# EasyEDA schematic SCH_Shuffl_2024-09-28.json
TITLE: Shuffl PCBC w/o battery; REV: 1.0; Date: 2024-09-28; Sheet: A/A; Drawn By: vasipallieshan; Company: StarKloud
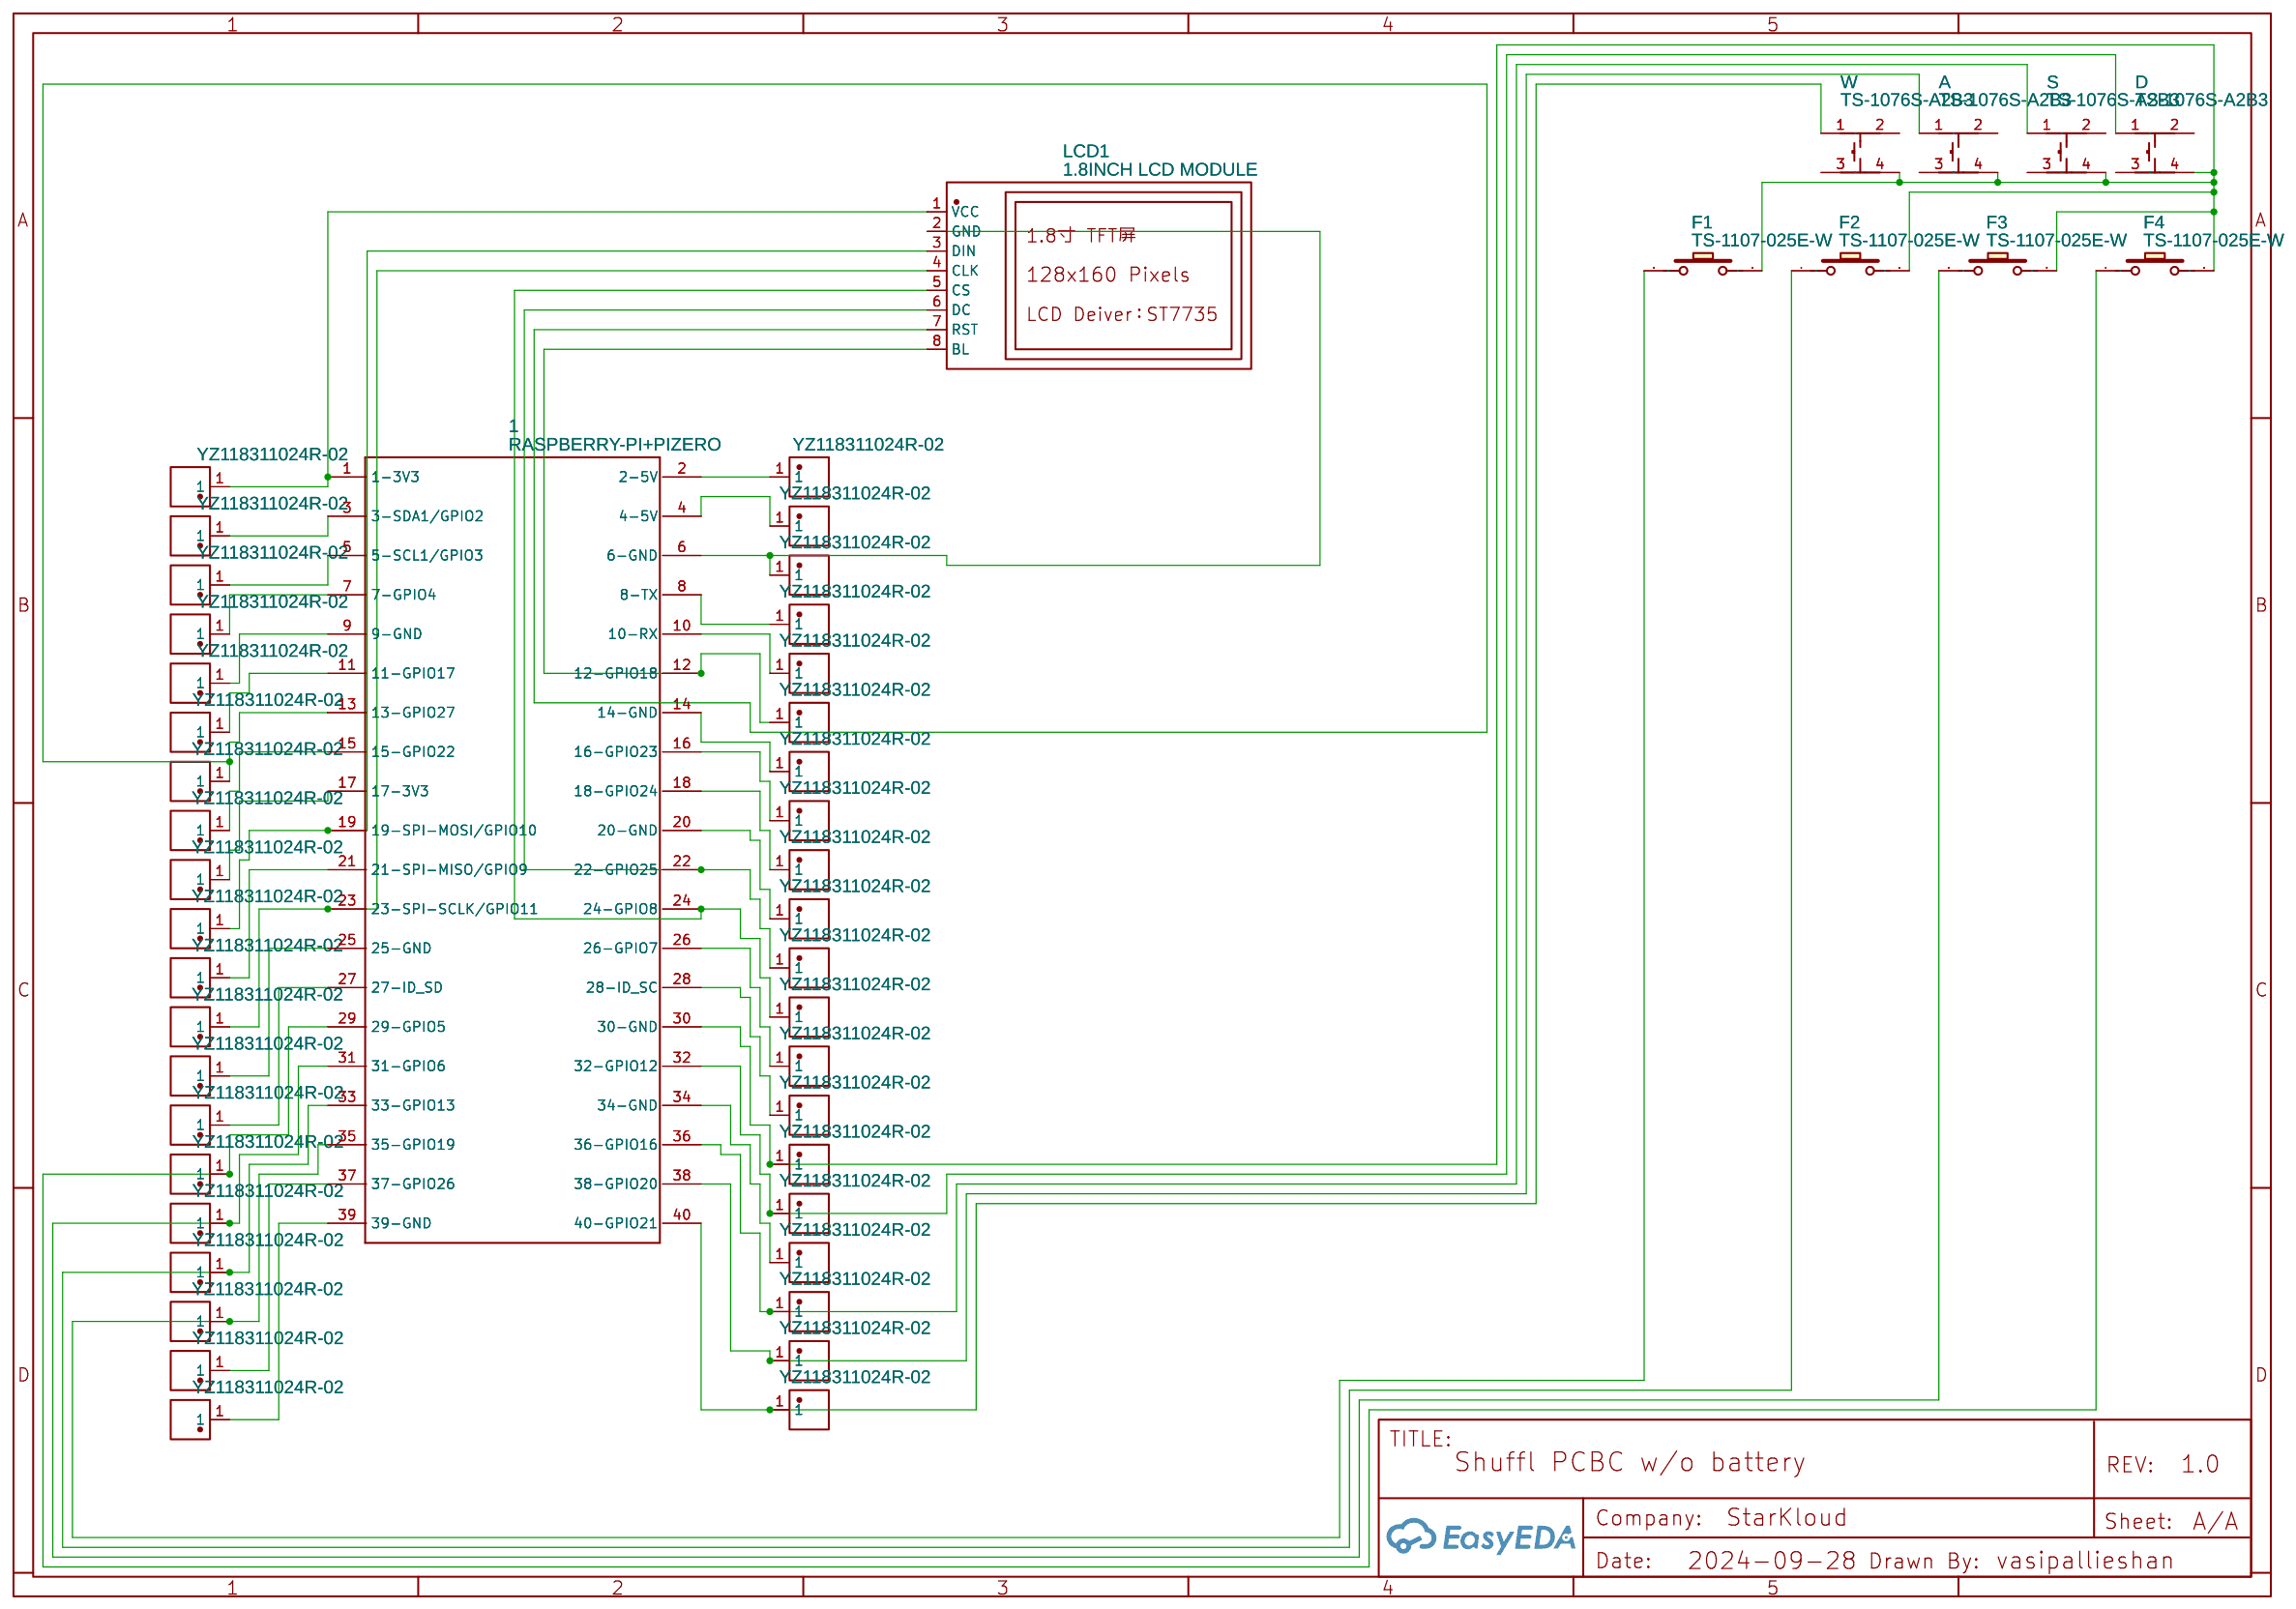
[diagram p0: schematic sheet]

## Parts
1  RASPBERRY-PI+PIZERO  [RASPBERRY-PI-ZERO]
2  YZ118311024R-02  [CONN-SMD_BD1.2_YZ118311024R-02]
3  YZ118311024R-02  [CONN-SMD_BD1.2_YZ118311024R-02]
4  YZ118311024R-02  [CONN-SMD_BD1.2_YZ118311024R-02]
5  YZ118311024R-02  [CONN-SMD_BD1.2_YZ118311024R-02]
6  YZ118311024R-02  [CONN-SMD_BD1.2_YZ118311024R-02]
7  YZ118311024R-02  [CONN-SMD_BD1.2_YZ118311024R-02]
8  YZ118311024R-02  [CONN-SMD_BD1.2_YZ118311024R-02]
9  YZ118311024R-02  [CONN-SMD_BD1.2_YZ118311024R-02]
10  YZ118311024R-02  [CONN-SMD_BD1.2_YZ118311024R-02]
11  YZ118311024R-02  [CONN-SMD_BD1.2_YZ118311024R-02]
12  YZ118311024R-02  [CONN-SMD_BD1.2_YZ118311024R-02]
13  YZ118311024R-02  [CONN-SMD_BD1.2_YZ118311024R-02]
14  YZ118311024R-02  [CONN-SMD_BD1.2_YZ118311024R-02]
15  YZ118311024R-02  [CONN-SMD_BD1.2_YZ118311024R-02]
16  YZ118311024R-02  [CONN-SMD_BD1.2_YZ118311024R-02]
17  YZ118311024R-02  [CONN-SMD_BD1.2_YZ118311024R-02]
18  YZ118311024R-02  [CONN-SMD_BD1.2_YZ118311024R-02]
19  YZ118311024R-02  [CONN-SMD_BD1.2_YZ118311024R-02]
20  YZ118311024R-02  [CONN-SMD_BD1.2_YZ118311024R-02]
21  YZ118311024R-02  [CONN-SMD_BD1.2_YZ118311024R-02]
22  YZ118311024R-02  [CONN-SMD_BD1.2_YZ118311024R-02]
23  YZ118311024R-02  [CONN-SMD_BD1.2_YZ118311024R-02]
24  YZ118311024R-02  [CONN-SMD_BD1.2_YZ118311024R-02]
25  YZ118311024R-02  [CONN-SMD_BD1.2_YZ118311024R-02]
26  YZ118311024R-02  [CONN-SMD_BD1.2_YZ118311024R-02]
27  YZ118311024R-02  [CONN-SMD_BD1.2_YZ118311024R-02]
28  YZ118311024R-02  [CONN-SMD_BD1.2_YZ118311024R-02]
29  YZ118311024R-02  [CONN-SMD_BD1.2_YZ118311024R-02]
30  YZ118311024R-02  [CONN-SMD_BD1.2_YZ118311024R-02]
31  YZ118311024R-02  [CONN-SMD_BD1.2_YZ118311024R-02]
32  YZ118311024R-02  [CONN-SMD_BD1.2_YZ118311024R-02]
33  YZ118311024R-02  [CONN-SMD_BD1.2_YZ118311024R-02]
34  YZ118311024R-02  [CONN-SMD_BD1.2_YZ118311024R-02]
35  YZ118311024R-02  [CONN-SMD_BD1.2_YZ118311024R-02]
36  YZ118311024R-02  [CONN-SMD_BD1.2_YZ118311024R-02]
37  YZ118311024R-02  [CONN-SMD_BD1.2_YZ118311024R-02]
38  YZ118311024R-02  [CONN-SMD_BD1.2_YZ118311024R-02]
39  YZ118311024R-02  [CONN-SMD_BD1.2_YZ118311024R-02]
40  YZ118311024R-02  [CONN-SMD_BD1.2_YZ118311024R-02]
A  TS-1076S-A2B3  [KEY-SMD_4P-L5.2-W5.2-P3.7-LS6.4-TL]
D  TS-1076S-A2B3  [KEY-SMD_4P-L5.2-W5.2-P3.7-LS6.4-TL]
F1  TS-1107-025E-W  [SW-SMD_L6.0-W3.7-LS8.0]
F2  TS-1107-025E-W  [SW-SMD_L6.0-W3.7-LS8.0]
F3  TS-1107-025E-W  [SW-SMD_L6.0-W3.7-LS8.0]
F4  TS-1107-025E-W  [SW-SMD_L6.0-W3.7-LS8.0]
GP  YZ118311024R-02  [CONN-SMD_BD1.2_YZ118311024R-02]
LCD1  1.8INCH LCD MODULE  [LCD-TH_L56.5-W34.0_1-8INCH-LCD-MODULE]
S  TS-1076S-A2B3  [KEY-SMD_4P-L5.2-W5.2-P3.7-LS6.4-TL]
W  TS-1076S-A2B3  [KEY-SMD_4P-L5.2-W5.2-P3.7-LS6.4-TL]

## Library data of the parts
1 = RASPBERRY-PI+PIZERO: Contributor: Simmy27
2-40 GP = YZ118311024R-02: Supplier: LCSC; Supplier Part: C5157376; Manufacturer: Xinyangze(鑫扬泽); JLCPCB Part Class: Extended Part; Contributor: lcsc
A D S W = TS-1076S-A2B3: Contributor: LCSC; Supplier: LCSC; Supplier Part: C492945; Manufacturer: Yuandi(元迪); JLCPCB Part Class: Extended Part
F1-F4 = TS-1107-025E-W: Contributor: lcsc; Supplier: LCSC; Supplier Part: C2939214; Manufacturer: HOOYA(皓宇电子); JLCPCB Part Class: Extended Part
LCD1 = 1.8INCH LCD MODULE: Supplier: LCSC; Supplier Part: C359940; Manufacturer: Waveshare(微雪电子); Manufacturer Part: 1.8inch LCD Module; JLCPCB Part Class: Extended Part; Contributor: lcsc

## Nets
Net-(1-1): 1.1(1-3V3) GP.1 LCD1.1(VCC)
Net-(1-2): 1.2(2-5V) 2.1
Net-(1-3): 1.3(3-SDA1/GPIO2) 3.1
Net-(1-4): 1.4(4-5V) 4.1
Net-(1-5): 1.5(5-SCL1/GPIO3) 5.1
Net-(1-6): 1.6(6-GND) 6.1 LCD1.2(GND)
Net-(1-7): 1.7(7-GPIO4) 7.1
Net-(1-8): 1.8(8-TX) 8.1
Net-(1-9): 1.9(9-GND) 9.1
Net-(1-10): 1.10(10-RX) 10.1
Net-(1-11): 1.11(11-GPIO17) 11.1
Net-(1-12): 1.12(12-GPIO18) 12.1 LCD1.8(BL)
Net-(1-13): 1.13(13-GPIO27) 13.1 LCD1.7(RST)
Net-(1-14): 1.14(14-GND) 14.1
Net-(1-15): 1.15(15-GPIO22) 15.1
Net-(1-16): 1.16(16-GPIO23) 16.1
Net-(1-17): 1.17(17-3V3) 17.1
Net-(1-18): 1.18(18-GPIO24) 18.1
Net-(1-19): 1.19(19-SPI-MOSI/GPIO10) 19.1 LCD1.3(DIN)
Net-(1-20): 1.20(20-GND) 20.1
Net-(1-21): 1.21(21-SPI-MISO/GPIO9) 21.1
Net-(1-22): 1.22(22-GPIO25) 22.1 LCD1.6(DC)
Net-(1-23): 1.23(23-SPI-SCLK/GPIO11) 23.1 LCD1.4(CLK)
Net-(1-24): 1.24(24-GPIO8) 24.1 LCD1.5(CS)
Net-(1-25): 1.25(25-GND) 25.1
Net-(1-26): 1.26(26-GPIO7) 26.1
Net-(1-27): 1.27(27-ID_SD) 27.1
Net-(1-28): 1.28(28-ID_SC) 28.1
Net-(1-29): 1.29(29-GPIO5) 29.1 F4.1
Net-(1-30): 1.30(30-GND) 30.1 A.4 D.4 F1.2 F2.2 F3.2 F4.2 S.4 W.4
Net-(1-31): 1.31(31-GPIO6) 31.1 F3.1
Net-(1-32): 1.32(32-GPIO12) 32.1 D.1
Net-(1-33): 1.33(33-GPIO13) 33.1 F2.1
Net-(1-34): 1.34(34-GND) 34.1
Net-(1-35): 1.35(35-GPIO19) 35.1 F1.1
Net-(1-36): 1.36(36-GPIO16) 36.1 S.1
Net-(1-37): 1.37(37-GPIO26) 37.1
Net-(1-38): 1.38(38-GPIO20) 38.1 A.1
Net-(1-39): 1.39(39-GND) 39.1
Net-(1-40): 1.40(40-GPIO21) 40.1 W.1

Not connected (* = marked no-connect by the designer): A 2 3; D 2 3; S 2 3; W 2 3
